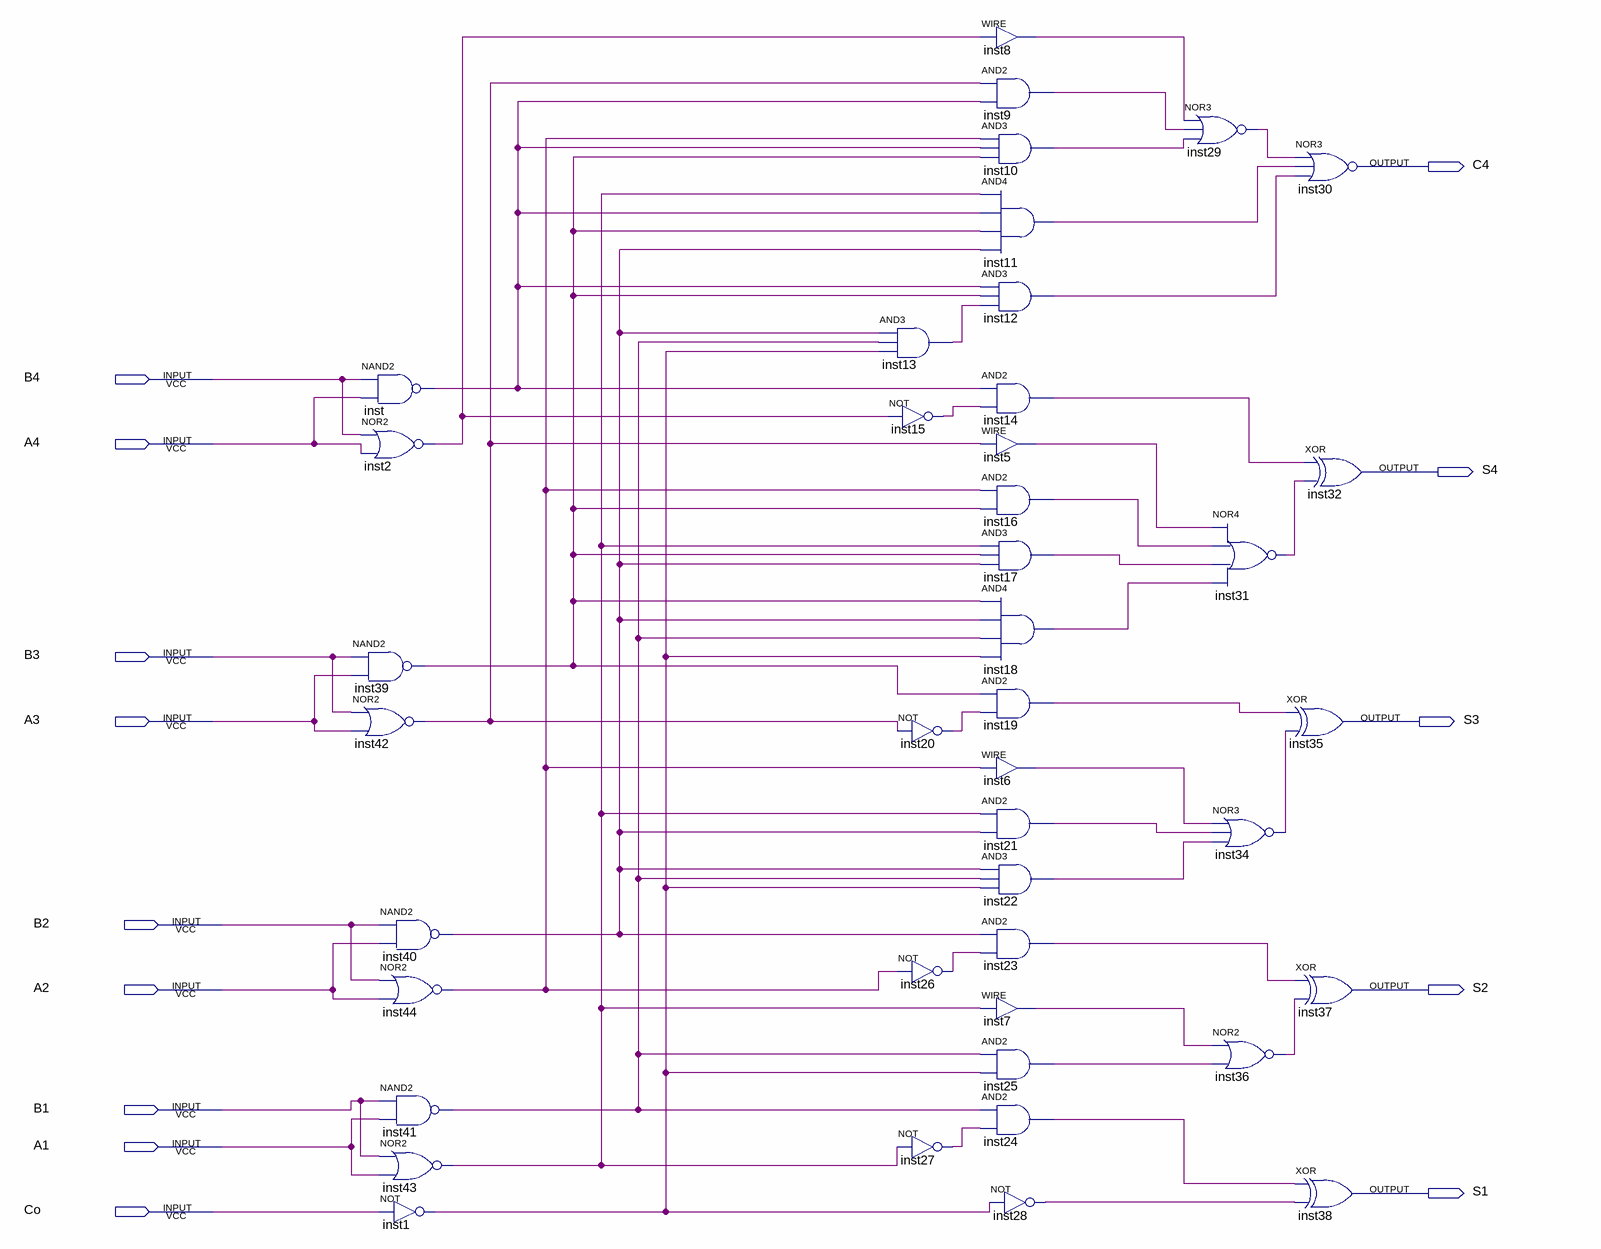
[diagram p0: schematic sheet]
// Quartus schematic Circuito_74LS83.bdf as structural Verilog: 42 symbols, 14 pins
module Circuito_74LS83 (
  input  B4,
  input  A4,
  input  B3,
  input  A3,
  input  B2,
  input  A2,
  input  B1,
  input  A1,
  input  Co,
  output C4,
  output S4,
  output S3,
  output S2,
  output S1
);

  wire inst1_out, inst2_out, inst5_out, inst6_out, inst7_out, inst8_out, inst9_out, inst10_out, inst11_out,
       inst12_out, inst13_out, inst14_out, inst15_out, inst16_out, inst17_out, inst18_out, inst19_out,
       inst20_out, inst21_out, inst22_out, inst23_out, inst24_out, inst25_out, inst26_out, inst27_out,
       inst28_out, inst29_out, inst31_out, inst34_out, inst36_out, inst39_out, inst40_out, inst41_out,
       inst42_out, inst43_out, inst44_out, inst_out;

  nand inst (inst_out, B4, A4);
  nor inst2 (inst2_out, B4, A4);
  nand inst39 (inst39_out, B3, A3);
  nor inst42 (inst42_out, B3, A3);
  nand inst40 (inst40_out, B2, A2);
  nor inst44 (inst44_out, B2, A2);
  nand inst41 (inst41_out, B1, A1);
  nor inst43 (inst43_out, B1, A1);
  not inst1 (inst1_out, Co);
  and inst13 (inst13_out, inst40_out, inst41_out, inst1_out);
  not inst15 (inst15_out, inst2_out);
  not inst20 (inst20_out, inst42_out);
  not inst26 (inst26_out, inst44_out);
  not inst27 (inst27_out, inst43_out);
  assign inst8_out = inst2_out;  // WIRE inst8
  and inst9 (inst9_out, inst42_out, inst_out);
  and inst10 (inst10_out, inst44_out, inst_out, inst39_out);
  and inst11 (inst11_out, inst43_out, inst_out, inst39_out, inst40_out);
  and inst12 (inst12_out, inst_out, inst39_out, inst13_out);
  and inst14 (inst14_out, inst_out, inst15_out);
  assign inst5_out = inst42_out;  // WIRE inst5
  and inst16 (inst16_out, inst44_out, inst39_out);
  and inst17 (inst17_out, inst43_out, inst39_out, inst40_out);
  and inst18 (inst18_out, inst39_out, inst40_out, inst41_out, inst1_out);
  and inst19 (inst19_out, inst39_out, inst20_out);
  assign inst6_out = inst44_out;  // WIRE inst6
  and inst21 (inst21_out, inst43_out, inst40_out);
  and inst22 (inst22_out, inst40_out, inst41_out, inst1_out);
  and inst23 (inst23_out, inst40_out, inst26_out);
  assign inst7_out = inst43_out;  // WIRE inst7
  and inst25 (inst25_out, inst41_out, inst1_out);
  and inst24 (inst24_out, inst41_out, inst27_out);
  not inst28 (inst28_out, inst1_out);
  nor inst29 (inst29_out, inst8_out, inst9_out, inst10_out);
  nor inst31 (inst31_out, inst5_out, inst16_out, inst17_out, inst18_out);
  nor inst34 (inst34_out, inst6_out, inst21_out, inst22_out);
  nor inst36 (inst36_out, inst7_out, inst25_out);
  nor inst30 (C4, inst29_out, inst11_out, inst12_out);
  xor inst32 (S4, inst14_out, inst31_out);
  xor inst35 (S3, inst19_out, inst34_out);
  xor inst37 (S2, inst23_out, inst36_out);
  xor inst38 (S1, inst24_out, inst28_out);
endmodule
